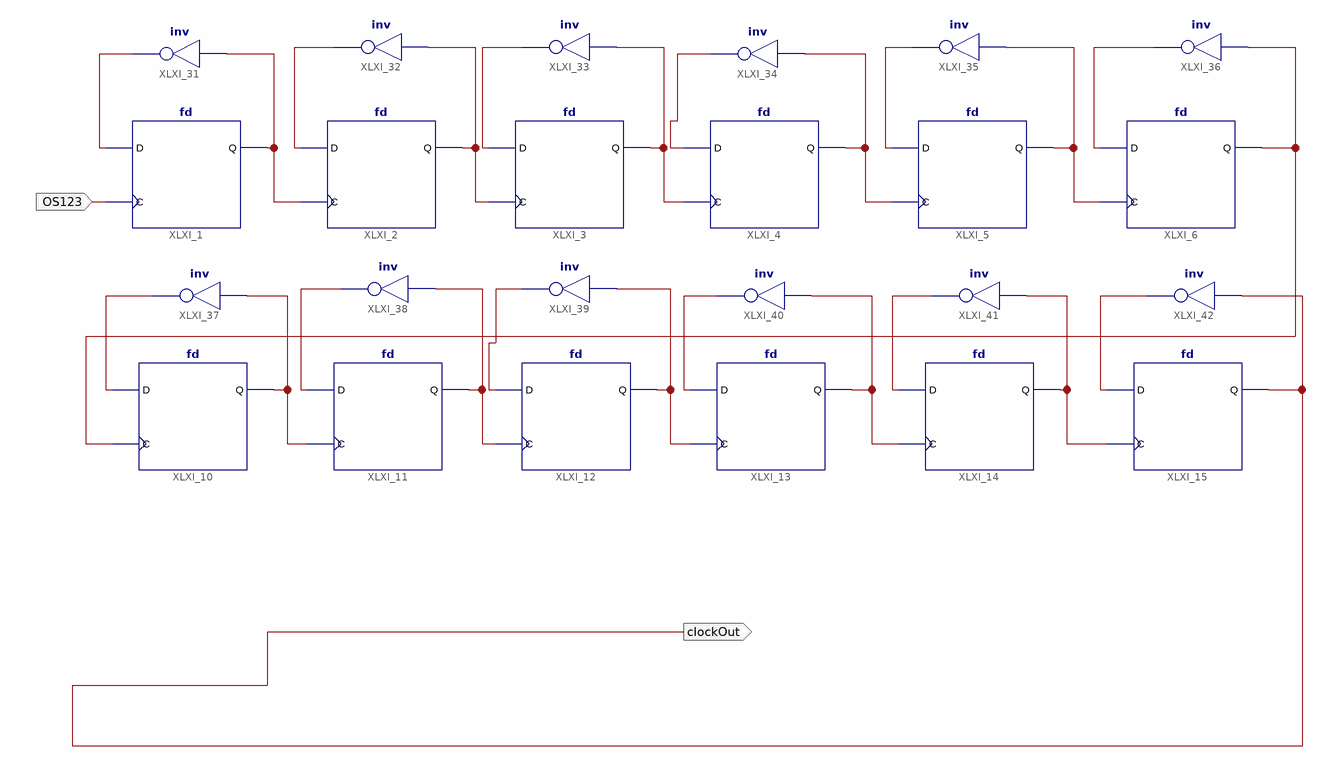
[diagram p0: schematic sheet 1]
// Xilinx ISE schematic clockdiv2.sch (spartan6) as structural Verilog: 24 symbols, 2 ports
module clockdiv2 (
  input  OS123,
  output clockOut
);

  wire XLXN_1, XLXN_2, XLXN_3, XLXN_4, XLXN_5, XLXN_6, XLXN_8, XLXN_9, XLXN_10, XLXN_11, XLXN_12, XLXN_13,
       XLXN_22, XLXN_23, XLXN_24, XLXN_25, XLXN_26, XLXN_27, XLXN_28, XLXN_29, XLXN_30, XLXN_31, XLXN_32;

  fd XLXI_1 (.C(OS123), .D(XLXN_2), .Q(XLXN_1));
  fd XLXI_2 (.C(XLXN_1), .D(XLXN_32), .Q(XLXN_3));
  fd XLXI_3 (.C(XLXN_3), .D(XLXN_31), .Q(XLXN_4));
  fd XLXI_4 (.C(XLXN_4), .D(XLXN_30), .Q(XLXN_5));
  fd XLXI_5 (.C(XLXN_5), .D(XLXN_29), .Q(XLXN_6));
  fd XLXI_6 (.C(XLXN_6), .D(XLXN_28), .Q(XLXN_8));
  fd XLXI_10 (.C(XLXN_8), .D(XLXN_27), .Q(XLXN_9));
  fd XLXI_11 (.C(XLXN_9), .D(XLXN_26), .Q(XLXN_10));
  fd XLXI_12 (.C(XLXN_10), .D(XLXN_25), .Q(XLXN_11));
  fd XLXI_13 (.C(XLXN_11), .D(XLXN_24), .Q(XLXN_12));
  fd XLXI_14 (.C(XLXN_12), .D(XLXN_23), .Q(XLXN_13));
  fd XLXI_15 (.C(XLXN_13), .D(XLXN_22), .Q(clockOut));
  not XLXI_31 (XLXN_2, XLXN_1);
  not XLXI_32 (XLXN_32, XLXN_3);
  not XLXI_33 (XLXN_31, XLXN_4);
  not XLXI_34 (XLXN_30, XLXN_5);
  not XLXI_35 (XLXN_29, XLXN_6);
  not XLXI_36 (XLXN_28, XLXN_8);
  not XLXI_37 (XLXN_27, XLXN_9);
  not XLXI_38 (XLXN_26, XLXN_10);
  not XLXI_39 (XLXN_25, XLXN_11);
  not XLXI_40 (XLXN_24, XLXN_12);
  not XLXI_41 (XLXN_23, XLXN_13);
  not XLXI_42 (XLXN_22, clockOut);
endmodule
